# Altium schematic sheet DRV8301.SchDoc
size 558 x 431 mm; Engineer: Nicholas Oborny; Revision: A.1; Name: Nicholas Oborny; Start Date: 7/23/2012
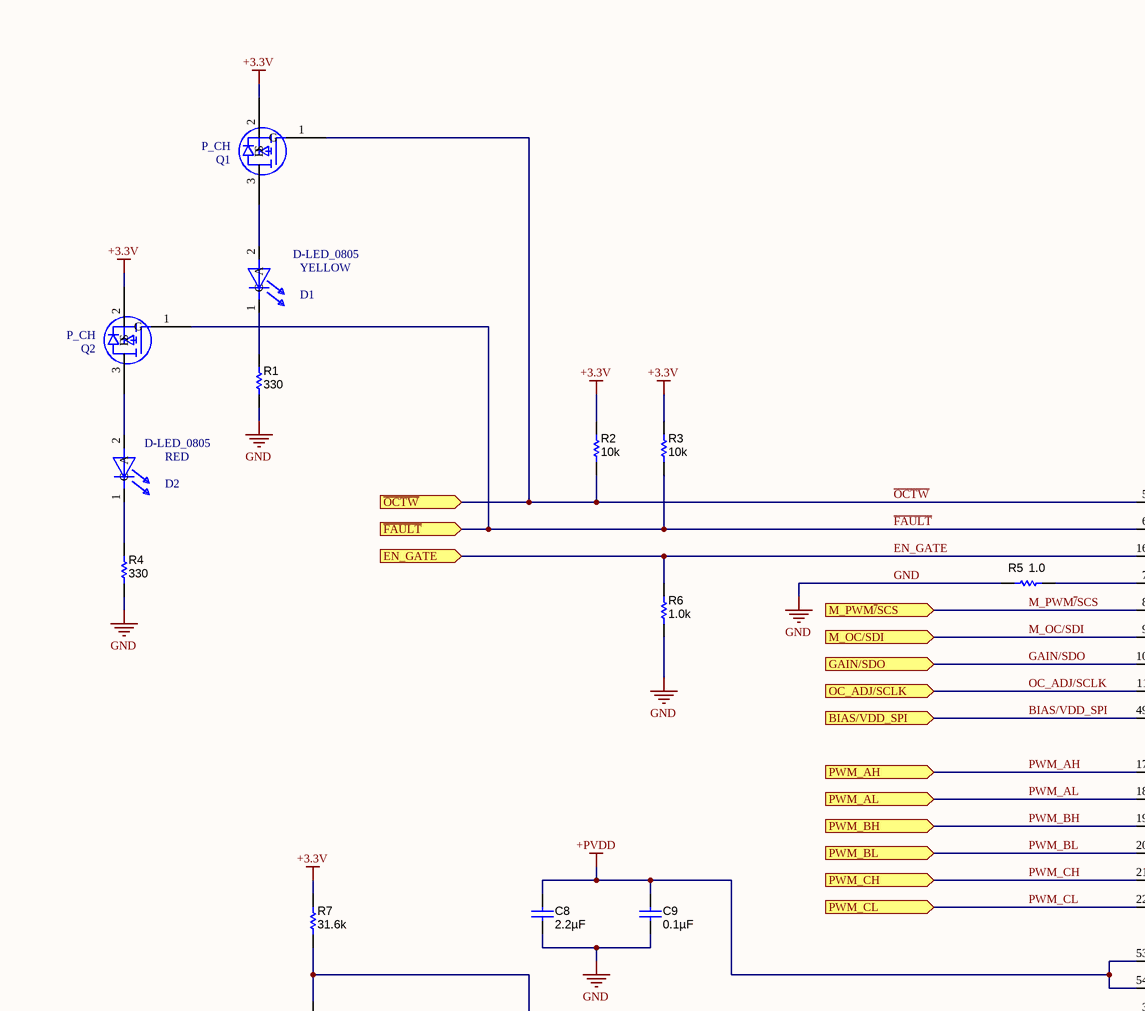
[diagram p0: DRV8301.SchDoc, top left]
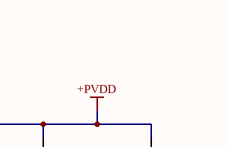
[diagram p1: DRV8301.SchDoc, top right]
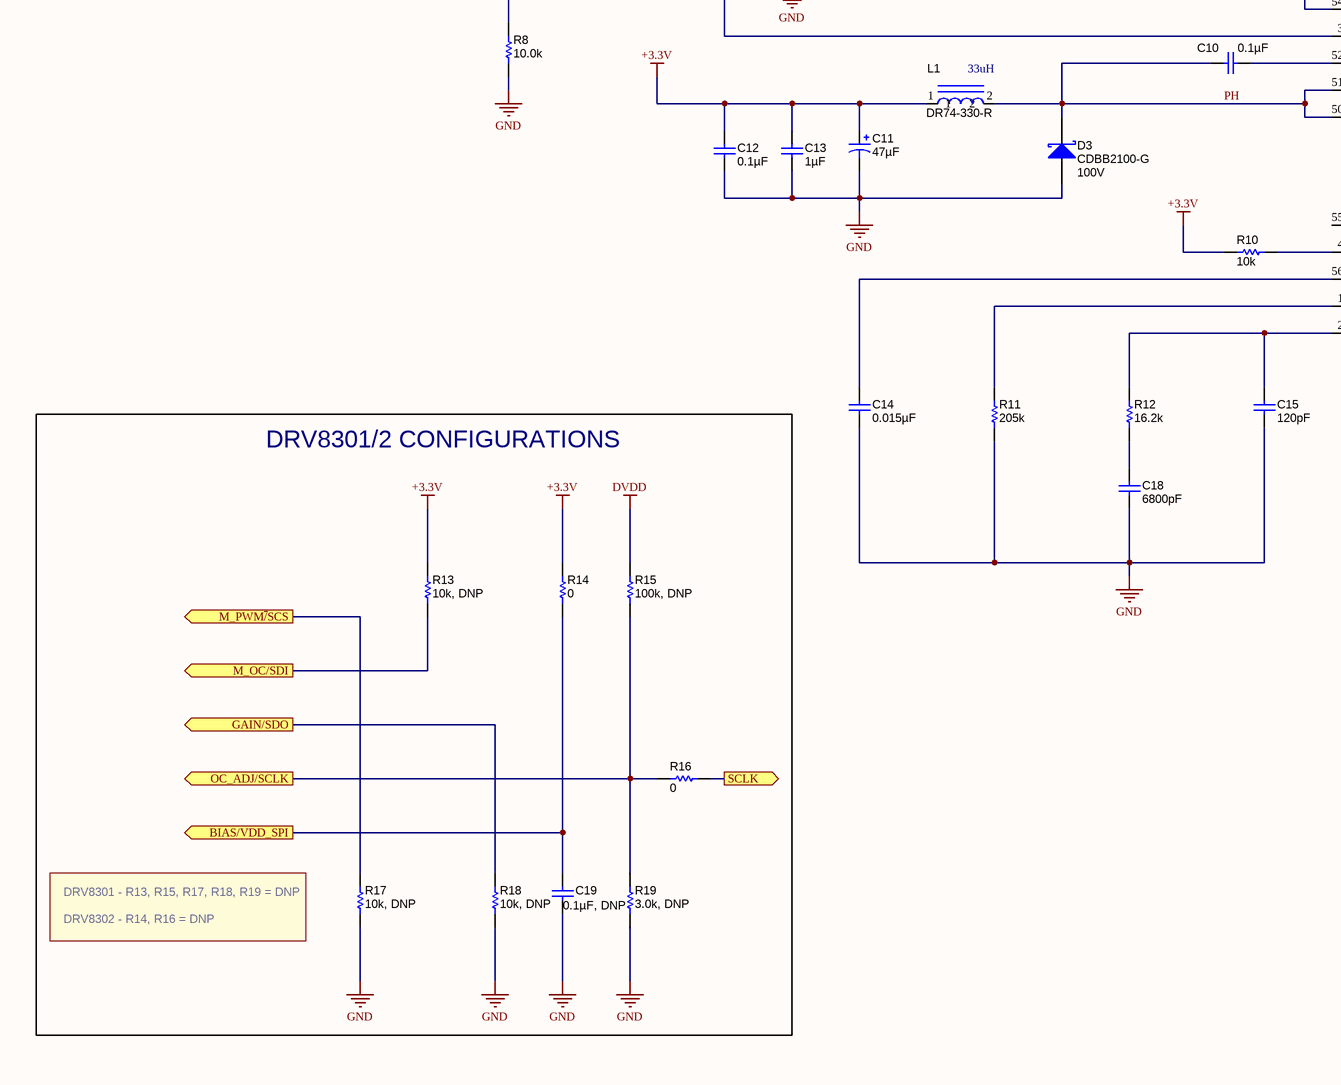
[diagram p2: DRV8301.SchDoc, bottom left]
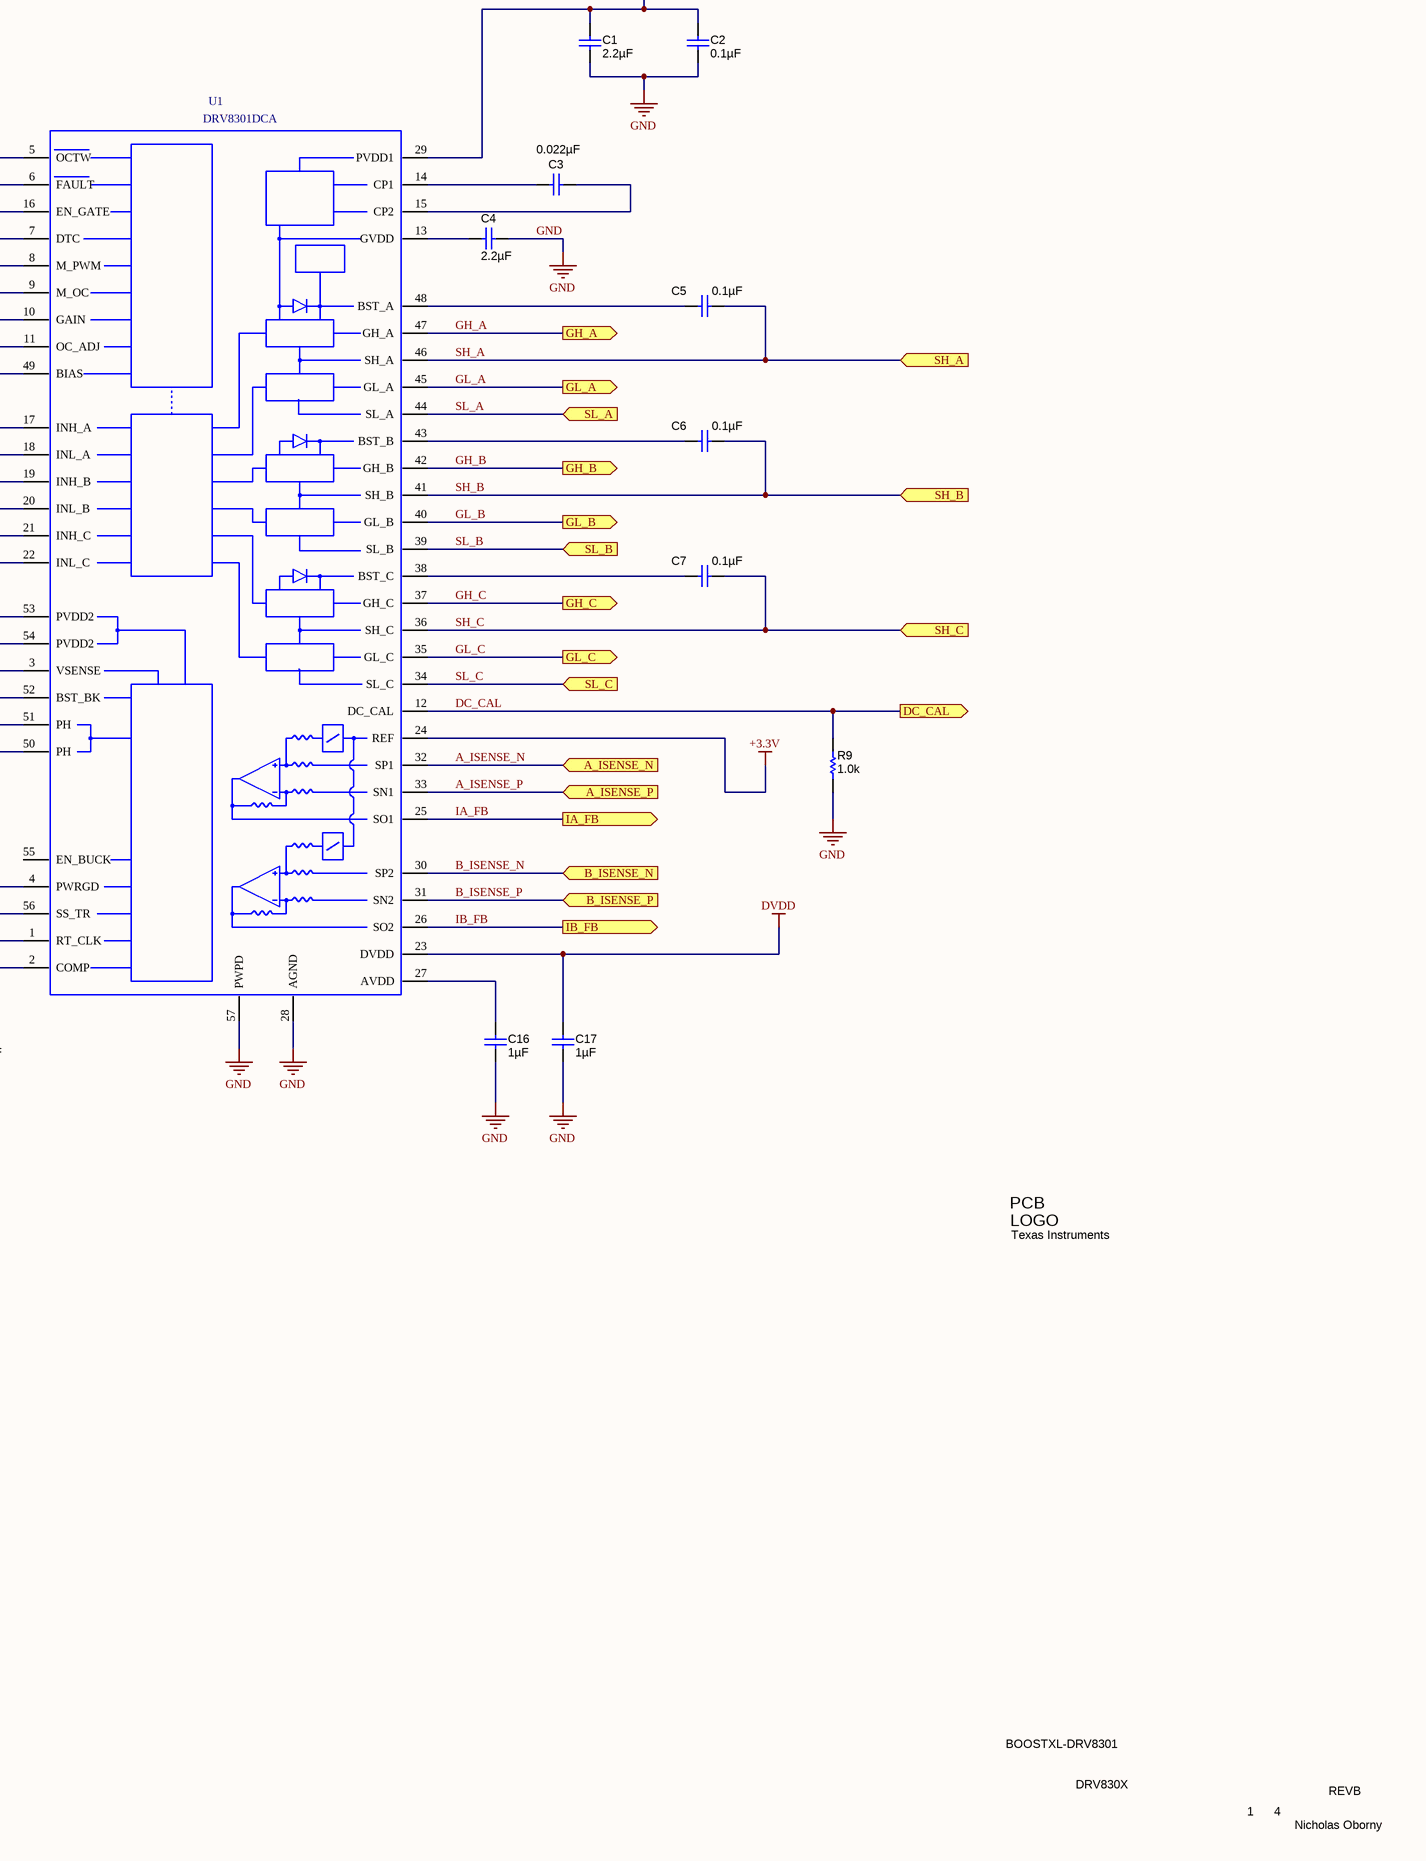
[diagram p3: DRV8301.SchDoc, bottom right]

## Parts
C1  ValueDisplayed: 2.2µF  [1210L]  (hidden comment: GRM32ER72A225KA35L)
C2  ValueDisplayed: 0.1µF  [0603L]  (hidden comment: GRM188R72A104KA35D)
C3  ValueDisplayed: 0.022µF  [0603L]  (hidden comment: C1608X7R1H223K)
C4  ValueDisplayed: 2.2µF  [0805L]  (hidden comment: GRM219R61E225KA12D)
C5  ValueDisplayed: 0.1µF  [0603L]  (hidden comment: C1608X7R1H104K)
C6  ValueDisplayed: 0.1µF  [0603L]  (hidden comment: C1608X7R1H104K)
C7  ValueDisplayed: 0.1µF  [0603L]  (hidden comment: C1608X7R1H104K)
C8  ValueDisplayed: 2.2µF  [1210L]  (hidden comment: GRM32ER72A225KA35L)
C9  ValueDisplayed: 0.1µF  [0603L]  (hidden comment: GRM188R72A104KA35D)
C10  ValueDisplayed: 0.1µF  [0603L]  (hidden comment: C1608X7R1H104K)
C11  ValueDisplayed: 47µF  [SM_RADIAL_D]  (hidden comment: EEE-FK1E470P)
C12  ValueDisplayed: 0.1µF  [0603L]  (hidden comment: C1608X7R1E104K)
C13  ValueDisplayed: 1µF  [0603L]  (hidden comment: C1608X5R1E105K080AC)
C14  ValueDisplayed: 0.015µF  [0603L]  (hidden comment: GRM188R71H153KA01D)
C15  ValueDisplayed: 120pF  [0603L]  (hidden comment: GRM1885C1H121JA01D)
C16  ValueDisplayed: 1µF  [0603L]  (hidden comment: GRM188R61E105KA12D)
C17  ValueDisplayed: 1µF  [0603L]  (hidden comment: GRM188R61E105KA12D)
C18  ValueDisplayed: 6800pF  [0603L]  (hidden comment: GRM188R71H682KA01D)
C19  ValueDisplayed: 0.1µF, DNP  [0603L]  (hidden comment: C1608X7R1E104K)
D1  D-LED_0805  value YELLOW  [LED_0805]
D2  D-LED_0805  value RED  [LED_0805]
D3  CDBB2100-G  value 100V  [SMB]
L1  DR74-330-R  value 33uH  [IND_DR74]
Logo1  Texas Instruments  [TI_Symbol_Overlay_Small]  (no BOM)
Q1  value P_CH  [SOT-23]  (hidden comment: TR_PFET_SOT23)
Q2  value P_CH  [SOT-23]  (hidden comment: TR_PFET_SOT23)
R1  value 330  [0603L]  (hidden comment: CRCW0603330RJNEA)
R2  value 10k  [0603L]  (hidden comment: CRCW060310K0JNEA)
R3  value 10k  [0603L]  (hidden comment: CRCW060310K0JNEA)
R4  value 330  [0603L]  (hidden comment: CRCW0603330RJNEA)
R5  value 1.0  [0603L]  (hidden comment: CRCW06031R00JNEA)
R6  value 1.0k  [0603L]  (hidden comment: CRCW06031K00JNEA)
R7  value 31.6k  [0603L]  (hidden comment: CRCW060331K6FKEA)
R8  value 10.0k  [0603L]  (hidden comment: RG1608P-103-B-T5)
R9  value 1.0k  [0603L]  (hidden comment: CRCW06031K00JNEA)
R10  value 10k  [0603L]  (hidden comment: CRCW060310K0JNEA)
R11  value 205k  [0603L]  (hidden comment: CRCW0603205KFKEA)
R12  value 16.2k  [0603L]  (hidden comment: CRCW060316K2FKEA)
R13  value 10k, DNP  [0603L]  (hidden comment: CRCW060310K0JNEA)
R14  value 0  [0603L]  (hidden comment: CRCW06030000Z0EA)
R15  value 100k, DNP  [0603L]  (hidden comment: CRCW0603100KJNEA)
R16  value 0  [0603L]  (hidden comment: CRCW06030000Z0EA)
R17  value 10k, DNP  [0603L]  (hidden comment: CRCW060310K0JNEA)
R18  value 10k, DNP  [0603L]  (hidden comment: CRCW060310K0JNEA)
R19  value 3.0k, DNP  [0603L]  (hidden comment: CRCW06033K00JNEA)
U1  DRV8301DCA  [DCA_56P]

## Blocks framed on the sheet
DRV8301/2 CONFIGURATIONS: C19 R13-R19

## Ports
A_ISENSE_N, A_ISENSE_P, B_ISENSE_N, B_ISENSE_P, BIAS/VDD_SPI, DC_CAL, EN_GATE, GAIN/SDO, GH_A, GH_B, GH_C, GL_A, GL_B, GL_C, IA_FB, IB_FB, M_OC/SDI, M_PWM~{/}SCS, OC_ADJ/SCLK, PWM_AH, PWM_AL, PWM_BH, PWM_BL, PWM_CH, PWM_CL, SCLK, SH_A, SH_B, SH_C, SL_A, SL_B, SL_C, ~{FAULT}, ~{OCTW}

## Nets
+3.3V: C11.1(+) C12.1 C13.1 L1.1 Q1.2(S) Q2.2(S) R2.2 R3.2 R7.2 R10.2 R13.2 R14.2 U1.24(REF)
+PVDD: C1.1 C2.1 C8.1 C9.1 U1.29(PVDD1) U1.53(PVDD2) U1.54(PVDD2)
DVDD: C17.1 R15.1 U1.23(DVDD)
GND: C1.2 C2.2 C4.2 C8.2 C9.2 C11.2(-) C12.2 C13.2 C14.2 C15.2 C16.2 C17.2 C18.2 C19.2 D3.2(A) R1.1 R4.1 R5.1 R6.1 R8.1 R9.1 R11.1 R17.1 R18.1 R19.1 U1.28(AGND) U1.57(PWPD)
~{FAULT}: Q2.1(G) R3.1 U1.6(FAULT) ; port ~{FAULT}
~{OCTW}: Q1.1(G) R2.1 U1.5(OCTW) ; port ~{OCTW}
A_ISENSE_N: U1.32(SP1) ; port A_ISENSE_N
A_ISENSE_P: U1.33(SN1) ; port A_ISENSE_P
B_ISENSE_N: U1.30(SP2) ; port B_ISENSE_N
B_ISENSE_P: U1.31(SN2) ; port B_ISENSE_P
BIAS/VDD_SPI: C19.1 R14.1 U1.49(BIAS) ; port BIAS/VDD_SPI
DC_CAL: R9.2 U1.12(DC_CAL) ; port DC_CAL
EN_GATE: R6.2 U1.16(EN_GATE) ; port EN_GATE
GAIN/SDO: R18.2 U1.10(GAIN) ; port GAIN/SDO
GH_A: U1.47(GH_A) ; port GH_A
GH_B: U1.42(GH_B) ; port GH_B
GH_C: U1.37(GH_C) ; port GH_C
GL_A: U1.45(GL_A) ; port GL_A
GL_B: U1.40(GL_B) ; port GL_B
GL_C: U1.35(GL_C) ; port GL_C
IA_FB: U1.25(SO1) ; port IA_FB
IB_FB: U1.26(SO2) ; port IB_FB
M_OC/SDI: R13.1 U1.9(M_OC) ; port M_OC/SDI
M_PWM~{/}SCS: R17.2 U1.8(M_PWM) ; port M_PWM~{/}SCS
OC_ADJ/SCLK: R15.2 R16.2 R19.2 U1.11(OC_ADJ) ; port OC_ADJ/SCLK
PH: C10.1 D3.1(K) L1.2 U1.50(PH) U1.51(PH)
PWM_AH: U1.17(INH_A) ; port PWM_AH
PWM_AL: U1.18(INL_A) ; port PWM_AL
PWM_BH: U1.19(INH_B) ; port PWM_BH
PWM_BL: U1.20(INL_B) ; port PWM_BL
PWM_CH: U1.21(INH_C) ; port PWM_CH
PWM_CL: U1.22(INL_C) ; port PWM_CL
SCLK: R16.1 ; port SCLK
SH_A: C5.2 U1.46(SH_A) ; port SH_A
SH_B: C6.2 U1.41(SH_B) ; port SH_B
SH_C: C7.2 U1.36(SH_C) ; port SH_C
SL_A: U1.44(SL_A) ; port SL_A
SL_B: U1.39(SL_B) ; port SL_B
SL_C: U1.34(SL_C) ; port SL_C
NetC3_1: C3.1 U1.14(CP1)
NetC3_2: C3.2 U1.15(CP2)
NetC4_1: C4.1 U1.13(GVDD)
NetC5_1: C5.1 U1.48(BST_A)
NetC6_1: C6.1 U1.43(BST_B)
NetC7_1: C7.1 U1.38(BST_C)
NetC10_2: C10.2 U1.52(BST_BK)
NetC14_1: C14.1 U1.56(SS_TR)
NetC15_1: C15.1 R12.2 U1.2(COMP)
NetC16_1: C16.1 U1.27(AVDD)
NetC18_1: C18.1 R12.1
NetD1_1: D1.1(C) R1.2
NetD1_2: D1.2(A) Q1.3(D)
NetD2_1: D2.1(C) R4.2
NetD2_2: D2.2(A) Q2.3(D)
NetR5_2: R5.2 U1.7(DTC)
NetR7_1: R7.1 R8.2 U1.3(VSENSE)
NetR10_1: R10.1 U1.4(PWRGD)
NetR11_2: R11.2 U1.1(RT_CLK)

Not connected (* = marked no-connect by the designer): U1 55(EN_BUCK)

## Notes on the sheet
- DRV8301 - R13, R15, R17, R18, R19 = DNP
- DRV8302 - R14, R16 = DNP
- BOOSTXL-DRV8301
- DRV830X
- 1
- 4
- REVB
- Nicholas Oborny
- (in symbol TI_Logo) PCB; LOGO

## Library data of the parts
C1 C8 = GRM32ER72A225KA35L: CAP, CERM, 2.2uF, 100V, +/-10%, X7R, 1210; Manufacturer: MuRata; Polarized: N; CompType: Capacitor; U/M: EA; Cap_F: 0.0000022; Tolerance_%: 10; ESR_Ohm: 0.007; Value1: 0.007 ohm; VDC_V: 100; IRMS_A: 4.4; TaMin_C: -55; TaMax_C: 125; Cap_Case: 1210; SymbolVersion: 2008-07-09; Value: 2.2uF; PartNumber: GRM32ER72A225KA35L; PackageReference: 1210; RoHS: Y; Value2: 100V; MountType: SMT; Technology: Ceramic; TempCo: X7R; Published: 2008-06-19; Publisher: Texas Instruments; LatestRevisionDate: 2013-05-24; LatestRevisionNote: Changed publisher; ComponentLink1Description: Datasheet link; ComponentLink1URL: http://search.murata.co.jp/Ceramy/PnsearchViewAction.do?HnOFG=ON&HnNFG=ON&SEL_CNT=50&sLang=en&sKey=GRM32ER72A225KA35L&x=9&y=9&search=startwith; Supplier 1: Digi-Key; Supplier Part Number 1: 490-3385-1-ND; Supplier 2: Mouser; Supplier Part Number 2: 81-GRM32ER72A225KA35; Supplier 3: Farnell; Supplier Part Number 3: 1735547
C2 C9 = GRM188R72A104KA35D: CAP, CERM, 0.1uF, 100V, +/-10%, X7R, 0603; Manufacturer: MuRata; Polarized: N; CompType: Capacitor; U/M: EA; Cap_F: 0.0000001; Tolerance_%: 10; Value1: Unknown; VDC_V: 100; TaMin_C: -55; TaMax_C: 125; Cap_Case: 0603; SymbolVersion: 2008-07-09; Value: 0.1uF; PartNumber: GRM188R72A104KA35D; PackageReference: 0603; RoHS: Y; Value2: 100V; MountType: SMT; Technology: Ceramic; TempCo: X7R; Published: 2008-06-19; Publisher: Texas Instruments; LatestRevisionDate: 2013-05-24; LatestRevisionNote: Changed publisher; ComponentLink1Description: Datasheet link; ComponentLink1URL: http://search.murata.co.jp/Ceramy/PnsearchViewAction.do?HnOFG=ON&HnNFG=ON&SEL_CNT=50&sLang=en&sKey=GRM188R72A104KA35D&x=9&y=9&search=startwith; Supplier 1: Digi-Key; Supplier Part Number 1: 490-3285-1-ND; Supplier 2: Mouser; Supplier Part Number 2: 81-GRM188R72A104KA35; Supplier 3: Farnell; Supplier Part Number 3: 1828921
C3 = C1608X7R1H223K: CAP, CERM, 0.022uF, 50V, +/-10%, X7R, 0603; Manufacturer: TDK; Polarized: N; CompType: Capacitor; U/M: EA; Cap_F: 0.000000022; Tolerance_%: 10; ESR_Ohm: 0.0383; Value1: 0.0383 ohm; VDC_V: 50; TaMin_C: -55; TaMax_C: 125; Cap_Case: 0603; SymbolVersion: 2008-07-09; Value: 0.022uF; PartNumber: C1608X7R1H223K; PackageReference: 0603; RoHS: Y; Value2: 50V; MountType: SMT; Technology: Ceramic; TempCo: X7R; Published: 2008-06-19; Publisher: Texas Instruments; LatestRevisionDate: 2013-05-24; LatestRevisionNote: Changed publisher; ComponentLink1Description: Datasheet link; ComponentLink1URL: http://www.tdk.co.jp/tefe02/e412_c.pdf; Supplier 1: Digi-Key; Supplier Part Number 1: 445-1312-1-ND; Supplier 2: Farnell; Supplier Part Number 2: 1907316
C4 = GRM219R61E225KA12D: CAP, CERM, 2.2uF, 25V, +/-10%, X5R, 0805; Manufacturer: MuRata; Polarized: N; CompType: Capacitor; U/M: EA; Cap_F: 0.0000022; Tolerance_%: 10; ESR_Ohm: 0.006; Value1: 0.006 ohm; VDC_V: 25; TaMin_C: -55; TaMax_C: 85; Cap_Case: 0805; SymbolVersion: 2008-07-09; Value: 2.2uF; PartNumber: GRM219R61E225KA12D; PackageReference: 0805; RoHS: Y; Value2: 25V; MountType: SMT; Technology: Ceramic; TempCo: X5R; Published: 2008-06-19; Publisher: Texas Instruments; LatestRevisionDate: 2013-05-24; LatestRevisionNote: Changed publisher; ComponentLink1Description: Datasheet link; ComponentLink1URL: http://search.murata.co.jp/Ceramy/PnsearchViewAction.do?HnOFG=ON&HnNFG=ON&SEL_CNT=50&sLang=en&sKey=GRM219R61E225KA12D&x=9&y=9&search=startwith; Supplier 1: Digi-Key; Supplier Part Number 1: 490-1701-1-ND; Supplier 2: Mouser; Supplier Part Number 2: 81-GRM219R61E225K; Supplier 3: Farnell; Supplier Part Number 3: 1845749
C5-C7 C10 = C1608X7R1H104K: CAP, CERM, 0.1uF, 50V, +/-10%, X7R, 0603; Manufacturer: TDK; Polarized: N; CompType: Capacitor; U/M: EA; Cap_F: 0.0000001; Tolerance_%: 10; ESR_Ohm: 0.017; Value1: 0.017 ohm; VDC_V: 50; TaMin_C: -55; TaMax_C: 125; Cap_Case: 0603; SymbolVersion: 2008-07-09; Value: 0.1uF; PartNumber: C1608X7R1H104K; PackageReference: 0603; RoHS: Y; Value2: 50V; MountType: SMT; Technology: Ceramic; TempCo: X7R; Published: 2008-06-19; Publisher: Texas Instruments; LatestRevisionDate: 2013-05-24; LatestRevisionNote: Changed publisher; ComponentLink1Description: Datasheet link; ComponentLink1URL: http://www.tdk.co.jp/tefe02/e412_c.pdf; Supplier 1: Digi-Key; Supplier Part Number 1: 445-1314-1-ND; Supplier 2: Farnell; Supplier Part Number 2: 1118182
C11 = EEE-FK1E470P: CAP, AL, 47uF, 25V, +/-20%, 0.36 ohm, SMD; Manufacturer: Panasonic; Polarized: Y; CompType: Capacitor; U/M: EA; Cap_F: 0.000047; Tolerance_%: 20; VDC_V: 25; ESR_Ohm: 0.36; IRMS_A: 0.24; TaMin_C: -55; TaMax_C: 105; Cap_Case: D; SymbolVersion: 2008-07-09; Value: 47uF; PartNumber: EEE-FK1E470P; PackageReference: SMT Radial D; RoHS: Y; Value1: 0.36 ohm; Value2: 25V; MountType: SMT; Technology: AL; Series: FK; Publisher: Texas Instruments; LatestRevisionDate: 2013-05-31; ComponentLink1Description: Datasheet link; ComponentLink1URL: http://www.panasonic.com/industrial/components/pdf/smt_aec_050505.pdf; Supplier 1: Digi-Key; Supplier Part Number 1: PCE3804CT-ND; Supplier 2: Mouser; Supplier Part Number 2: 667-EEE-FK1E470P; Supplier 3: Farnell; Supplier Part Number 3: 9695753
C12 C19 = C1608X7R1E104K: CAP, CERM, 0.1uF, 25V, +/-10%, X7R, 0603; Manufacturer: TDK; Polarized: N; CompType: Capacitor; U/M: EA; Cap_F: 0.0000001; Tolerance_%: 10; ESR_Ohm: 0.017; Value1: 0.017 ohm; VDC_V: 25; TaMin_C: -55; TaMax_C: 125; Cap_Case: 0603; SymbolVersion: 2008-07-09; Value: 0.1uF; PartNumber: C1608X7R1E104K; PackageReference: 0603; RoHS: Y; Value2: 25V; MountType: SMT; Technology: Ceramic; TempCo: X7R; Published: 2008-06-19; Publisher: Texas Instruments; LatestRevisionDate: 2013-05-24; LatestRevisionNote: Changed publisher; ComponentLink1Description: Datasheet link; ComponentLink1URL: http://www.tdk.co.jp/tefe02/e412_c.pdf; Supplier 1: Digi-Key; Supplier Part Number 1: 445-1316-1-ND; Supplier 2: Farnell; Supplier Part Number 2: 1844230
C13 = C1608X5R1E105K080AC: CAP, CERM, 1uF, 25V, +/-10%, X5R, 0603; Manufacturer: TDK; Polarized: N; CompType: Capacitor; U/M: EA; Cap_F: 0.000001; Tolerance_%: 10; Value1: Unknown; VDC_V: 25; TaMin_C: -55; TaMax_C: 85; Cap_Case: 0603; SymbolVersion: 2008-07-09; Value: 1uF; PartNumber: C1608X5R1E105K080AC; PackageReference: 0603; RoHS: Y; Value2: 25V; MountType: SMT; Technology: Ceramic; TempCo: X5R; Published: 2008-06-19; Publisher: Texas Instruments; LatestRevisionDate: 2013-05-24; LatestRevisionNote: Changed publisher; ComponentLink1Description: Datasheet link; ComponentLink1URL: http://product.tdk.com/capacitor/mlcc/en/documents/mlcc_commercial_general_en.pdf; Supplier 1: Digi-Key; Supplier Part Number 1: 445-5146-1-ND; Supplier 2: Newark; Supplier Part Number 2: 90R7677
C14 = GRM188R71H153KA01D: CAP, CERM, 0.015uF, 50V, +/-10%, X7R, 0603; Manufacturer: MuRata; Polarized: N; CompType: Capacitor; U/M: EA; Cap_F: 0.000000015; Tolerance_%: 10; Value1: Unknown; VDC_V: 50; TaMin_C: -55; TaMax_C: 125; Cap_Case: 0603; SymbolVersion: 2008-07-09; Value: 0.015uF; PartNumber: GRM188R71H153KA01D; PackageReference: 0603; RoHS: Y; Value2: 50V; MountType: SMT; Technology: Ceramic; TempCo: X7R; Published: 2008-06-19; Publisher: Texas Instruments; LatestRevisionDate: 2013-05-24; LatestRevisionNote: Changed publisher; ComponentLink1Description: Datasheet link; ComponentLink1URL: http://search.murata.co.jp/Ceramy/PnsearchViewAction.do?HnOFG=ON&HnNFG=ON&SEL_CNT=50&sLang=en&sKey=GRM188R71H153KA01D&x=9&y=9&search=startwith; Supplier 1: Digi-Key; Supplier Part Number 1: 490-1514-1-ND; Supplier 2: Mouser; Supplier Part Number 2: 81-GRM18R71H153KA01D; Supplier 3: Farnell; Supplier Part Number 3: 1828916
C15 = GRM1885C1H121JA01D: CAP, CERM, 120pF, 50V, +/-5%, C0G/NP0, 0603; Manufacturer: MuRata; Polarized: N; CompType: Capacitor; U/M: EA; Cap_F: 0.00000000012; Tolerance_%: 5; Value1: Unknown; VDC_V: 50; TaMin_C: -55; TaMax_C: 125; Cap_Case: 0603; SymbolVersion: 2008-07-09; Value: 120pF; PartNumber: GRM1885C1H121JA01D; PackageReference: 0603; RoHS: Y; Value2: 50V; MountType: SMT; Technology: Ceramic; TempCo: C0G/NP0; Published: 2008-06-19; Publisher: Texas Instruments; LatestRevisionDate: 2013-05-24; LatestRevisionNote: Changed publisher; ComponentLink1Description: Datasheet link; ComponentLink1URL: http://search.murata.co.jp/Ceramy/PnsearchViewAction.do?HnOFG=ON&HnNFG=ON&SEL_CNT=50&sLang=en&sKey=GRM1885C1H121JA01D&x=9&y=9&search=startwith; Supplier 1: Digi-Key; Supplier Part Number 1: 490-1429-1-ND; Supplier 2: Mouser; Supplier Part Number 2: 81-GRM39C121J50; Supplier 3: Farnell; Supplier Part Number 3: 1403555
C16 C17 = GRM188R61E105KA12D: CAP, CERM, 1uF, 25V, +/-10%, X5R, 0603; Manufacturer: MuRata; Polarized: N; CompType: Capacitor; U/M: EA; Cap_F: 0.000001; Tolerance_%: 10; Value1: Unknown; VDC_V: 25; TaMin_C: -55; TaMax_C: 85; Cap_Case: 0603; SymbolVersion: 2008-07-09; Value: 1uF; PartNumber: GRM188R61E105KA12D; PackageReference: 0603; RoHS: Y; Value2: 25V; MountType: SMT; Technology: Ceramic; TempCo: X5R; Published: 2008-06-19; Publisher: Texas Instruments; LatestRevisionDate: 2013-05-24; LatestRevisionNote: Changed publisher; ComponentLink1Description: Datasheet link; ComponentLink1URL: http://search.murata.co.jp/Ceramy/PnsearchViewAction.do?HnOFG=ON&HnNFG=ON&SEL_CNT=50&sLang=en&sKey=GRM188R61E105KA12D&x=9&y=9&search=startwith; Supplier 1: Digi-Key; Supplier Part Number 1: 490-3897-1-ND; Supplier 2: Mouser; Supplier Part Number 2: 81-GRM188R61E105KA12; Supplier 3: Farnell; Supplier Part Number 3: 1828802
C18 = GRM188R71H682KA01D: CAP, CERM, 6800pF, 50V, +/-10%, X7R, 0603; Manufacturer: MuRata; Polarized: N; CompType: Capacitor; U/M: EA; Cap_F: 0.0000000068; Tolerance_%: 10; Value1: Unknown; VDC_V: 50; TaMin_C: -55; TaMax_C: 125; Cap_Case: 0603; SymbolVersion: 2008-07-09; Value: 6800pF; PartNumber: GRM188R71H682KA01D; PackageReference: 0603; RoHS: Y; Value2: 50V; MountType: SMT; Technology: Ceramic; TempCo: X7R; Published: 2008-06-19; Publisher: Texas Instruments; LatestRevisionDate: 2013-05-24; LatestRevisionNote: Changed publisher; ComponentLink1Description: Datasheet link; ComponentLink1URL: http://search.murata.co.jp/Ceramy/PnsearchViewAction.do?HnOFG=ON&HnNFG=ON&SEL_CNT=50&sLang=en&sKey=GRM188R71H682KA01D&x=9&y=9&search=startwith; Supplier 1: Digi-Key; Supplier Part Number 1: 490-1508-1-ND; Supplier 2: Mouser; Supplier Part Number 2: 81-GRM39X682K50D; Supplier 3: Farnell; Supplier Part Number 3: 1403792
D1 = D-LED_0805: LED THIN 585NM YEL DIFF 0805 SMD; PartNumber: SML-LXT0805YW-TR; Manufacturer: Lumex Opto/Components Inc; Vendor Part #: 67-1554-1-ND; PCB DECAL: LED-0805DA; Vendor: DigiKey; ModifyDate: 10/26/2011 10:26:35; ComponentHeight: 0.80 mm; Size: 805
D2 = D-LED_0805: LED THIN660NM SUPRED DIFF0805SMD; PartNumber: SML-LXT0805SRW-TR; Manufacturer: Lumex Opto/Components Inc; Vendor Part #: 67-1555-1-ND; Vendor: DigiKey; ModifyDate: 10/26/2011 10:26:35; PCB DECAL: LED-0805; ComponentHeight: 0.80 mm; Size: 805
D3 = CDBC5100-G: Diode, Schottky, 100V, 2A, SMB; Manufacturer: Comchip Technology; U/M: EA; Vf_V: 0.85; Value2: 0.85V; Io_A: 2; Vr_V: 100; TJmax_C: 125; CompType: Diode; SymbolVersion: 2008-12-08; PartNumber: CDBB2100-G; PackageReference: SMB; Value1: 2A; MountType: SMT; Type: Schottky; RoHS: Y; Published: 2008-06-26; Publisher: Texas Instruments; LatestRevisionDate: 2013-06-04; ComponentLink1Description: Datasheet link; ComponentLink1URL: http://www.comchiptech.com/cms/UserFiles/CDBB220-G%20Thru935254.%20CDBB2100-G%20RevB.pdf; Supplier 1: Digi-Key; Supplier Part Number 1: 641-1109-1-ND; Supplier 2: Mouser; Supplier Part Number 2: 750-CDBB2100-G
L1 = IND_DR74-XXX: INDUCTOR SHIELD PWR 33UH SMD; Manufacturer: Cooper Bussmann; Area: 122500; ComponentLink1URL: \\vette02\pmp_pcb\pcad_pdf's\DR series inductor.pdf; ComponentHeight: 0.175; PackageReference: 0.300" sq; SymbolVersion: 07/31/2009 12:17:29; PartNumber: DR74-330-R; ComponentLink1Description: AEO Datasheet Link
Logo1 = TI_Logo: Texas Instrument Corporate Signature; SymbolCreator: codlsc; SymbolVersion: 2011-08-22; ClassName: Logo; Published: 2009-03-03; Publisher: Texas Instruments; LatestRevisionDate: 2012-05-17; LatestRevisionNote: Changed publisher
Q1 Q2 = TR_PFET_SOT23: MOSFET P-CH 8V 5.4A SOT23-3; PartNumber: SI2325DS-T1-E3; Manufacturer: Vishey Siliconix; Vendor Part #: S12325DS-T1-E3CT-ND; Vendor: DigiKey; ModifyDate: 11/01/2006 14:12:04; ComponentHeight: 0.043 inch; PCB DECAL: SOT-23; Size: SOT-23
R1 R4 = CRCW0603330RJNEA: RES, 330 ohm, 5%, 0.1W, 0603; Manufacturer: Vishay-Dale; CompType: Resistor; Value_Code: 330R; Tolerance_%: 5; Power_W: 0.1; VDC_V: 75; TempCo: 200 ppm/C; EIA_Code: E24; U/M: EA; SymbolVersion: 2009-05-29; PartNumber: CRCW0603330RJNEA; PackageReference: 0603; RoHS: Y; Res_ohm: 330; Value1: 5%; Value2: 0.1W; MountType: SMT; Technology: Thick Film; Published: 2008-06-26; Publisher: Texas Instruments; LatestRevisionDate: 2013-01-08; ComponentLink1Description: Datasheet link; ComponentLink1URL: http://www.vishay.com/docs/20035/dcrcwe3.pdf; Supplier 1: Digi-Key; Supplier Part Number 1: 541-330GCT-ND; Supplier 2: Mouser; Supplier Part Number 2: 71-CRCW0603J-330-E3; Supplier 3: Farnell; Supplier Part Number 3: 1692522
R2 R3 R10 = CRCW060310K0JNEA: RES, 10k ohm, 5%, 0.1W, 0603; Manufacturer: Vishay-Dale; CompType: Resistor; Res_ohm: 10000; Value_Code: 10k0; Tolerance_%: 5; Power_W: 0.1; VDC_V: 75; TempCo: 200 ppm/C; EIA_Code: E24; U/M: EA; SymbolVersion: 2009-05-29; PartNumber: CRCW060310K0JNEA; PackageReference: 0603; RoHS: Y; Value1: 5%; Value2: 0.1W; MountType: SMT; Technology: Thick Film; Published: 2008-06-26; Publisher: Texas Instruments; LatestRevisionDate: 2013-01-08; ComponentLink1Description: Datasheet link; ComponentLink1URL: http://www.vishay.com/docs/20035/dcrcwe3.pdf; Supplier 1: Digi-Key; Supplier Part Number 1: 541-10KGCT-ND; Supplier 2: Farnell; Supplier Part Number 2: 1562240; Supplier 3: Newark; Supplier Part Number 3: 52K8066
R5 = CRCW06031R00JNEA: RES, 1.0 ohm, 5%, 0.1W, 0603; Manufacturer: Vishay-Dale; CompType: Resistor; Res_ohm: 1; Value_Code: 1R00; Tolerance_%: 5; Power_W: 0.1; VDC_V: 75; TempCo: 200 ppm/C; EIA_Code: E24; U/M: EA; SymbolVersion: 2009-05-29; PartNumber: CRCW06031R00JNEA; PackageReference: 0603; RoHS: Y; Value1: 5%; Value2: 0.1W; MountType: SMT; Technology: Thick Film; Published: 2008-06-26; Publisher: Texas Instruments; LatestRevisionDate: 2013-01-08; ComponentLink1Description: Datasheet link; ComponentLink1URL: http://www.vishay.com/docs/20035/dcrcwe3.pdf; Supplier 1: Digi-Key; Supplier Part Number 1: 541-1.0GCT-ND; Supplier 2: Mouser; Supplier Part Number 2: 71-CRCW0603J-1-E3; Supplier 3: Farnell; Supplier Part Number 3: 1514709
R6 R9 = CRCW06031K00JNEA: RES, 1.0k ohm, 5%, 0.1W, 0603; Manufacturer: Vishay-Dale; CompType: Resistor; Res_ohm: 1000; Value_Code: 1k00; Tolerance_%: 5; Power_W: 0.1; VDC_V: 75; TempCo: 200 ppm/C; EIA_Code: E24; U/M: EA; SymbolVersion: 2009-05-29; PartNumber: CRCW06031K00JNEA; PackageReference: 0603; RoHS: Y; Value1: 5%; Value2: 0.1W; MountType: SMT; Technology: Thick Film; Published: 2008-06-26; Publisher: Texas Instruments; LatestRevisionDate: 2013-01-08; ComponentLink1Description: Datasheet link; ComponentLink1URL: http://www.vishay.com/docs/20035/dcrcwe3.pdf; Supplier 1: Digi-Key; Supplier Part Number 1: 541-1.0KGCT-ND; Supplier 2: Farnell; Supplier Part Number 2: 1652851; Supplier 3: Newark; Supplier Part Number 3: 59M6750
R7 = CRCW060331K6FKEA: RES, 31.6k ohm, 1%, 0.1W, 0603; Manufacturer: Vishay-Dale; CompType: Resistor; Res_ohm: 31600; Value_Code: 31k6; Tolerance_%: 1; Power_W: 0.1; VDC_V: 75; TempCo: 100 ppm/C; EIA_Code: E96; U/M: EA; SymbolVersion: 2009-05-29; PartNumber: CRCW060331K6FKEA; PackageReference: 0603; RoHS: Y; Value1: 1%; Value2: 0.1W; MountType: SMT; Technology: Thick Film; Published: 2008-06-26; Publisher: Texas Instruments; LatestRevisionDate: 2013-01-08; ComponentLink1Description: Datasheet link; ComponentLink1URL: http://www.vishay.com/docs/20035/dcrcwe3.pdf; Supplier 1: Digi-Key; Supplier Part Number 1: 541-31.6KHCT-ND; Supplier 2: Mouser; Supplier Part Number 2: 71-CRCW0603-31.6K-E3; Supplier 3: Farnell; Supplier Part Number 3: 1151933
R8 = RG1608P-103-B-T5: RES, 10.0k ohm, 0.1%, 0.1W, 0603; Manufacturer: Susumu Co Ltd; CompType: Resistor; Res_ohm: 10000; Value_Code: 10k0; Tolerance_%: 0.1; VDC_V: 75; TempCo: 25 ppm/C; EIA_Code: E192; U/M: EA; SymbolVersion: 2009-05-29; PartNumber: RG1608P-103-B-T5; PackageReference: 0603; RoHS: Y; Value1: 0.1%; Power_W: 0.1; Value2: 0.1W; MountType: SMT; Technology: Metal Film; Published: 2008-06-26; Publisher: Texas Instruments; LatestRevisionDate: 2013-01-08; ComponentLink1Description: Datasheet link; ComponentLink1URL: http://www.susumu.co.jp/english/pdf/products-j01-01.pdf; Supplier 1: Digi-Key; Supplier Part Number 1: RG16P10.0KBCT-ND; Supplier 2: Mouser; Supplier Part Number 2: 754-RG1608P-103-B-T5; Supplier 3: Farnell; Supplier Part Number 3: 1797079
R11 = CRCW0603205KFKEA: RES, 205k ohm, 1%, 0.1W, 0603; Manufacturer: Vishay-Dale; CompType: Resistor; Res_ohm: 205000; Tolerance_%: 1; Power_W: 0.1; VDC_V: 75; TempCo: 100 ppm/C; EIA_Code: E96; U/M: EA; SymbolVersion: 2009-05-29; PartNumber: CRCW0603205KFKEA; PackageReference: 0603; RoHS: Y; Value_Code: 205k; Value1: 1%; Value2: 0.1W; MountType: SMT; Technology: Thick Film; Published: 2008-06-26; Publisher: Texas Instruments; LatestRevisionDate: 2013-01-08; ComponentLink1Description: Datasheet link; ComponentLink1URL: http://www.vishay.com/docs/20035/dcrcwe3.pdf; Supplier 1: Digi-Key; Supplier Part Number 1: 541-205KHCT-ND; Supplier 2: Mouser; Supplier Part Number 2: 71-CRCW0603-205K-E3; Supplier 3: Farnell; Supplier Part Number 3: 1151818
R12 = CRCW060316K2FKEA: RES, 16.2k ohm, 1%, 0.1W, 0603; Manufacturer: Vishay-Dale; CompType: Resistor; Res_ohm: 16200; Value_Code: 16k2; Tolerance_%: 1; Power_W: 0.1; VDC_V: 75; TempCo: 100 ppm/C; EIA_Code: E96; U/M: EA; SymbolVersion: 2009-05-29; PartNumber: CRCW060316K2FKEA; PackageReference: 0603; RoHS: Y; Value1: 1%; Value2: 0.1W; MountType: SMT; Technology: Thick Film; Published: 2008-06-26; Publisher: Texas Instruments; LatestRevisionDate: 2013-01-08; ComponentLink1Description: Datasheet link; ComponentLink1URL: http://www.vishay.com/docs/20035/dcrcwe3.pdf; Supplier 1: Digi-Key; Supplier Part Number 1: 541-16.2KHCT-ND; Supplier 2: Mouser; Supplier Part Number 2: 71-CRCW0603-16.2K-E3; Supplier 3: Farnell; Supplier Part Number 3: 1151719
R13 R17 R18 = CRCW060310K0JNEA: RES, 10k ohm, 5%, 0.1W, 0603; Manufacturer: Vishay-Dale; Alternate Manufacturer: DNP; CompType: Resistor; Res_ohm: 10000; Value_Code: 10k0; Tolerance_%: 5; Power_W: 0.1; VDC_V: 75; TempCo: 200 ppm/C; EIA_Code: E24; U/M: EA; SymbolVersion: 2009-05-29; PartNumber: CRCW060310K0JNEA; PackageReference: 0603; RoHS: Y; Value1: 5%; Value2: 0.1W; MountType: SMT; Technology: Thick Film; Published: 2008-06-26; Publisher: Texas Instruments; LatestRevisionDate: 2013-01-08; ComponentLink1Description: Datasheet link; ComponentLink1URL: http://www.vishay.com/docs/20035/dcrcwe3.pdf; Alternate PartNumber: DNP; Supplier 1: Digi-Key; Supplier Part Number 1: 541-10KGCT-ND; Supplier 2: Farnell; Supplier Part Number 2: 1562240; Supplier 3: Newark; Supplier Part Number 3: 52K8066
R14 R16 = CRCW06030000Z0EA: RES, 0 ohm, 5%, 0.1W, 0603; Manufacturer: Vishay-Dale; CompType: Resistor; Value_Code: 0000; Tolerance_%: 5; Power_W: 0.1; VDC_V: 75; TempCo: 200 ppm/C; EIA_Code: E24; U/M: EA; SymbolVersion: 2009-05-29; PartNumber: CRCW06030000Z0EA; PackageReference: 0603; RoHS: Y; Res_ohm: 0; Value1: 5%; Value2: 0.1W; MountType: SMT; Technology: Thick Film; Published: 2008-06-26; Publisher: Texas Instruments; LatestRevisionDate: 2013-01-08; ComponentLink1Description: Datasheet link; ComponentLink1URL: http://www.vishay.com/docs/20035/dcrcwe3.pdf; Supplier 1: Digi-Key; Supplier Part Number 1: 541-0.0GCT-ND; Supplier 2: Mouser; Supplier Part Number 2: 71-CRCW0603-0-E3; Supplier 3: Farnell; Supplier Part Number 3: 1469739
R15 = CRCW0603100KJNEA: RES, 100k ohm, 5%, 0.1W, 0603; Manufacturer: Vishay-Dale; Alternate Manufacturer: DNP; CompType: Resistor; Res_ohm: 100000; Tolerance_%: 5; Power_W: 0.1; VDC_V: 75; TempCo: 200 ppm/C; EIA_Code: E24; U/M: EA; SymbolVersion: 2009-05-29; PartNumber: CRCW0603100KJNEA; PackageReference: 0603; RoHS: Y; Value_Code: 100k; Value1: 5%; Value2: 0.1W; MountType: SMT; Technology: Thick Film; Published: 2008-06-26; Publisher: Texas Instruments; LatestRevisionDate: 2013-01-08; ComponentLink1Description: Datasheet link; ComponentLink1URL: http://www.vishay.com/docs/20035/dcrcwe3.pdf; Alternate PartNumber: DNP; Supplier 1: Mouser; Supplier Part Number 1: 71-CRCW0603J-100K-E3; Supplier 2: Farnell; Supplier Part Number 2: 1692517; Supplier 3: Newark; Supplier Part Number 3: 59M6763
R19 = CRCW06033K00JNEA: RES, 3.0k ohm, 5%, 0.1W, 0603; Manufacturer: Vishay-Dale; Alternate Manufacturer: DNP; CompType: Resistor; Res_ohm: 3000; Value_Code: 3k00; Tolerance_%: 5; Power_W: 0.1; VDC_V: 75; TempCo: 200 ppm/C; EIA_Code: E24; U/M: EA; SymbolVersion: 2009-05-29; PartNumber: CRCW06033K00JNEA; PackageReference: 0603; RoHS: Y; Value1: 5%; Value2: 0.1W; MountType: SMT; Technology: Thick Film; Published: 2008-06-26; Publisher: Texas Instruments; LatestRevisionDate: 2013-01-08; ComponentLink1Description: Datasheet link; ComponentLink1URL: http://www.vishay.com/docs/20035/dcrcwe3.pdf; Alternate PartNumber: DNP; Supplier 1: Mouser; Supplier Part Number 1: 71-CRCW0603J-3.0K-E3; Supplier 2: Farnell; Supplier Part Number 2: 1563613; Supplier 3: Newark; Supplier Part Number 3: 72M6833
U1 = DRV8302DCA_ERIC: IC, 3 Phase Pre-Driver with Dual Current Shunt Amplifiers and Buck Regulator-Hardware Controlled; Manufacturer: Texas Instruments; Area: 154.44 mm; Vendor: Supplied; Value: DRV8301DCA; ModifyDate: 05/02/2012 07:50:13; PartNumber: DRV8301DCA; Size: HTSSOP; PCB DECAL: DCA_56P; Vendor Part #: Supplied